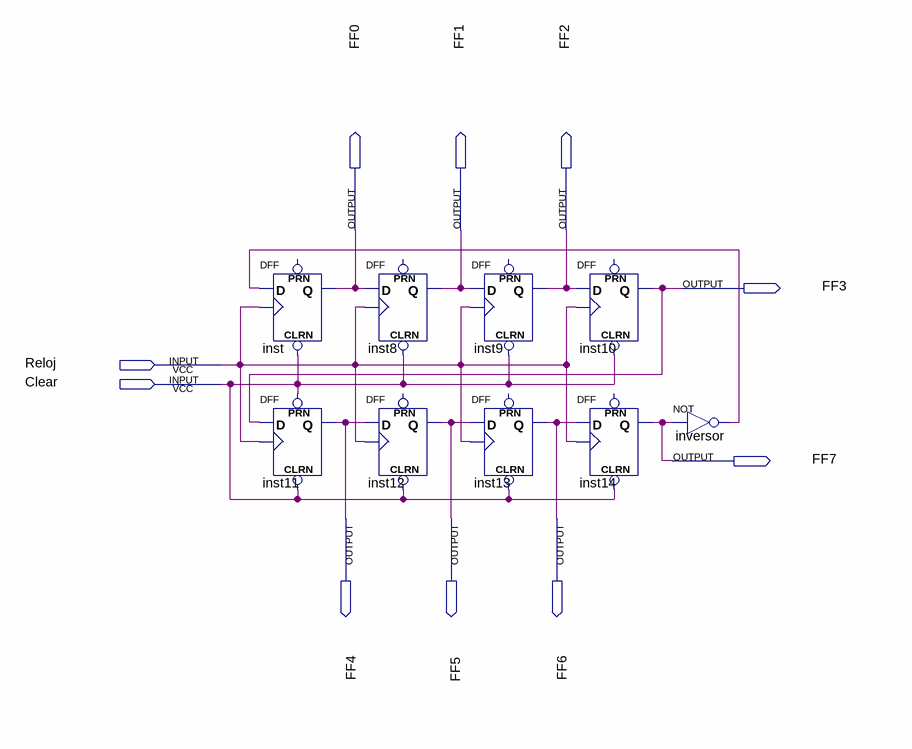
[diagram p0: schematic sheet]
// Quartus schematic ContadorJhonson.bdf as structural Verilog: 9 symbols, 10 pins
module ContadorJhonson (
  input  Reloj,
  input  Clear,
  output FF0,
  output FF1,
  output FF2,
  output FF3,
  output FF7,
  output FF4,
  output FF5,
  output FF6
);

  wire inversor_out;

  DFF inst (.CLRN(Clear), .CLK(Reloj), .D(inversor_out), .Q(FF0));  // open: PRN
  DFF inst11 (.CLRN(Clear), .CLK(Reloj), .D(FF3), .PRN(Clear), .Q(FF4));
  DFF inst8 (.CLRN(Clear), .CLK(Reloj), .D(FF0), .Q(FF1));  // open: PRN
  DFF inst12 (.CLRN(Clear), .CLK(Reloj), .D(FF4), .Q(FF5));  // open: PRN
  DFF inst9 (.CLRN(Clear), .CLK(Reloj), .D(FF1), .Q(FF2));  // open: PRN
  DFF inst13 (.CLRN(Clear), .CLK(Reloj), .D(FF5), .Q(FF6));  // open: PRN
  DFF inst10 (.CLRN(Clear), .CLK(Reloj), .D(FF2), .Q(FF3));  // open: PRN
  DFF inst14 (.CLRN(Clear), .CLK(Reloj), .D(FF6), .Q(FF7));  // open: PRN
  not inversor (inversor_out, FF7);
endmodule
